# EAGLE design SimplePiddy (EAGLE 6.5.0)
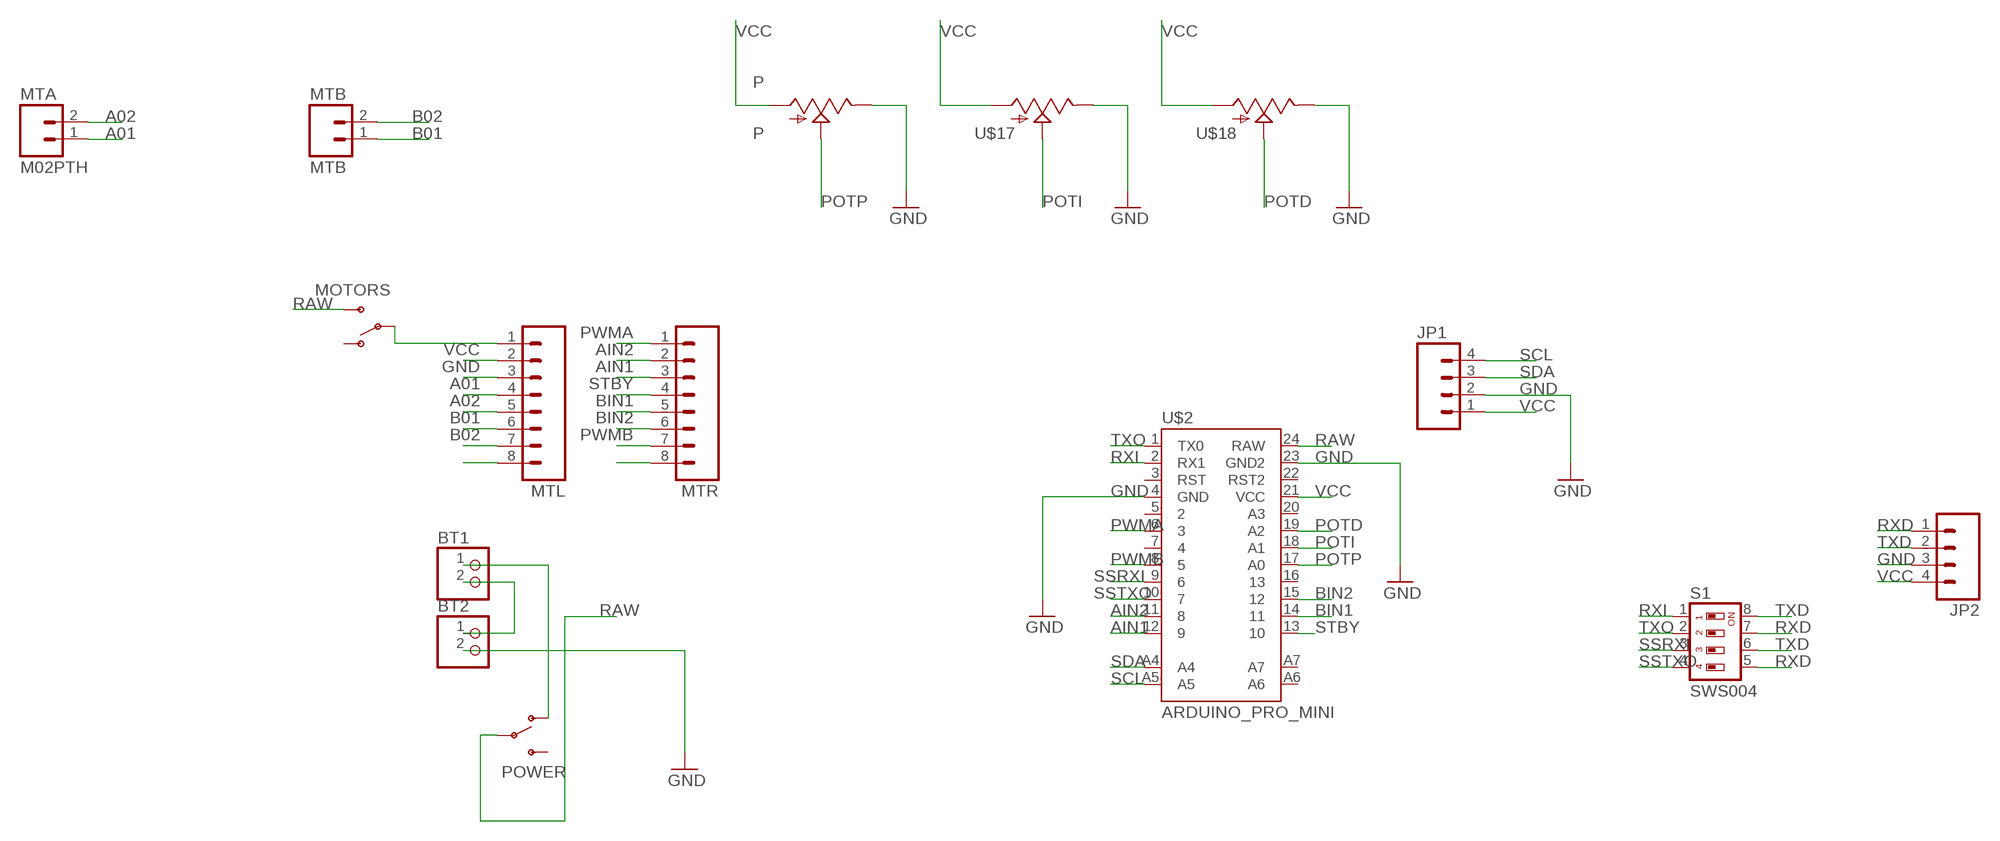
[diagram p0: schematic, sheet 1]

## Parts
BT1  JST_2PIN  [JSTPH2STRAIGHT]
BT2  JST_2PIN  [JSTPH2STRAIGHT]
JP1  M04PTH  [1X04]
JP2  M04PTH  [1X04]
MOTORS  SWITCH-SPDTPTH  [SWITCH-SPDT]
MTA  M02PTH  [1X02]
MTB  MTB  M02PTH  [1X02]
MTL  M08LONGPADS  [1X08_LONGPADS]
MTR  M08LONGPADS  [1X08_LONGPADS]
P  P  POT  [ALPS_POT]
POWER  SWITCH-SPDTPTH  [SWITCH-SPDT]
S1  SWS004  [SMS-004]
U$2  ARDUINO_PRO_MINI  [ARDUINO_PRO_MINI]
U$17  POT  [ALPS_POT]
U$18  POT  [ALPS_POT]

## Nets
A01: MTA.1 MTL.4
A02: MTA.2 MTL.5
AIN1: MTR.3 U$2.12
AIN2: MTR.2 U$2.11
B01: MTB.1 MTL.6
B02: MTB.2 MTL.7
BIN1: MTR.5 U$2.14
BIN2: MTR.6 U$2.15
GND [vcc]: BT2.2 JP1.2 JP2.3 MTL.3 MTL.8 MTR.8 P.P$1(E) U$2.4(GND) U$2.23(GND2) U$17.P$1(E) U$18.P$1(E)
N$1: MOTORS.2(P) MTL.1
N$17: BT1.2 BT2.1
N$18: BT1.1 POWER.1(O)
POTD: U$2.19(A2) U$18.P$2(S)
POTI: U$2.18(A1) U$17.P$2(S)
POTP: P.P$2(S) U$2.17(A0)
PWMA: MTR.1 U$2.6
PWMB: MTR.7 U$2.8
RAW: MOTORS.3(S) POWER.2(P) U$2.24(RAW)
RXD: JP2.1 S1.5 S1.7
RXI: S1.1 U$2.2(RX1)
SCL: JP1.4 U$2.A5
SDA: JP1.3 U$2.A4
SSRXI: S1.3 U$2.9
SSTXO: S1.4 U$2.10
STBY: MTR.4 U$2.13
TXD: JP2.2 S1.6 S1.8
TXO: S1.2 U$2.1(TX0)
VCC: JP1.1 JP2.4 MTL.2 P.P$3(A) U$2.21(VCC) U$17.P$3(A) U$18.P$3(A)
Unconnected: MOTORS.1(O) POWER.3(S) U$2.3(RST) U$2.5 U$2.7 U$2.16 U$2.20(A3) U$2.22(RST2) U$2.A6 U$2.A7

## Library data of the parts
BT1 BT2 = microbuilder:JST_2PIN: JST 2-Pin Right-Angle Connector PH-Series - 4UConnector: 17311 SH-Series - 4UConnector: 07278
JP1 JP2 = SparkFun-Connectors:M04: Header 4 Standard 4-pin 0.1" header. Use with straight break away headers (SKU : PRT-00116), right angle break away headers (PRT-00553), swiss pins (PRT-00743), machine pins (PRT-00117), and female headers (PRT-00115). Molex polarized connector foot print use with SKU : PRT-08231 with associated crimp pins and housings. 1MM SMD Version SKU: PRT-10208
MOTORS POWER = SparkFun-Electromechanical:SWITCH-SPDT: SPDT Switch Simple slide switch, Spark Fun Electronics SKU : COM-00102 DPDT SMT slide switch, AYZ0202, SWCH-08179
MTA MTB = SparkFun-Connectors:M02: Standard 2-pin 0.1" header. Use with - straight break away headers ( PRT-00116) - right angle break away headers (PRT-00553) - swiss pins (PRT-00743) - machine pins (PRT-00117) - female headers (PRT-00115) Molex polarized connector foot print use with: PRT-08233 with associated crimp pins and housings. 2.54_SCREWTERM for use with PRT-10571. 3.5mm Screw Terminal footprints for PRT-08084 5mm Screw Terminal footprints for use with PRT-08433
MTL MTR = SparkFun-Connectors:M08: Header 8 Standard 8-pin 0.1" header. Use with straight break away headers (SKU : PRT-00116), right angle break away headers (PRT-00553), swiss pins (PRT-00743), machine pins (PRT-00117), and female headers (PRT-00115).
P U$17 U$18 = SparkFun-Electromechanical:POT
S1 = smd-special:SWS004: SMD Dip Switch 4 pol.
U$2 = SparkFun-Boards_NoConnector:ARDUINO_PRO_MINI

## Net classes
1 vcc: width 0.254 mm

## Board
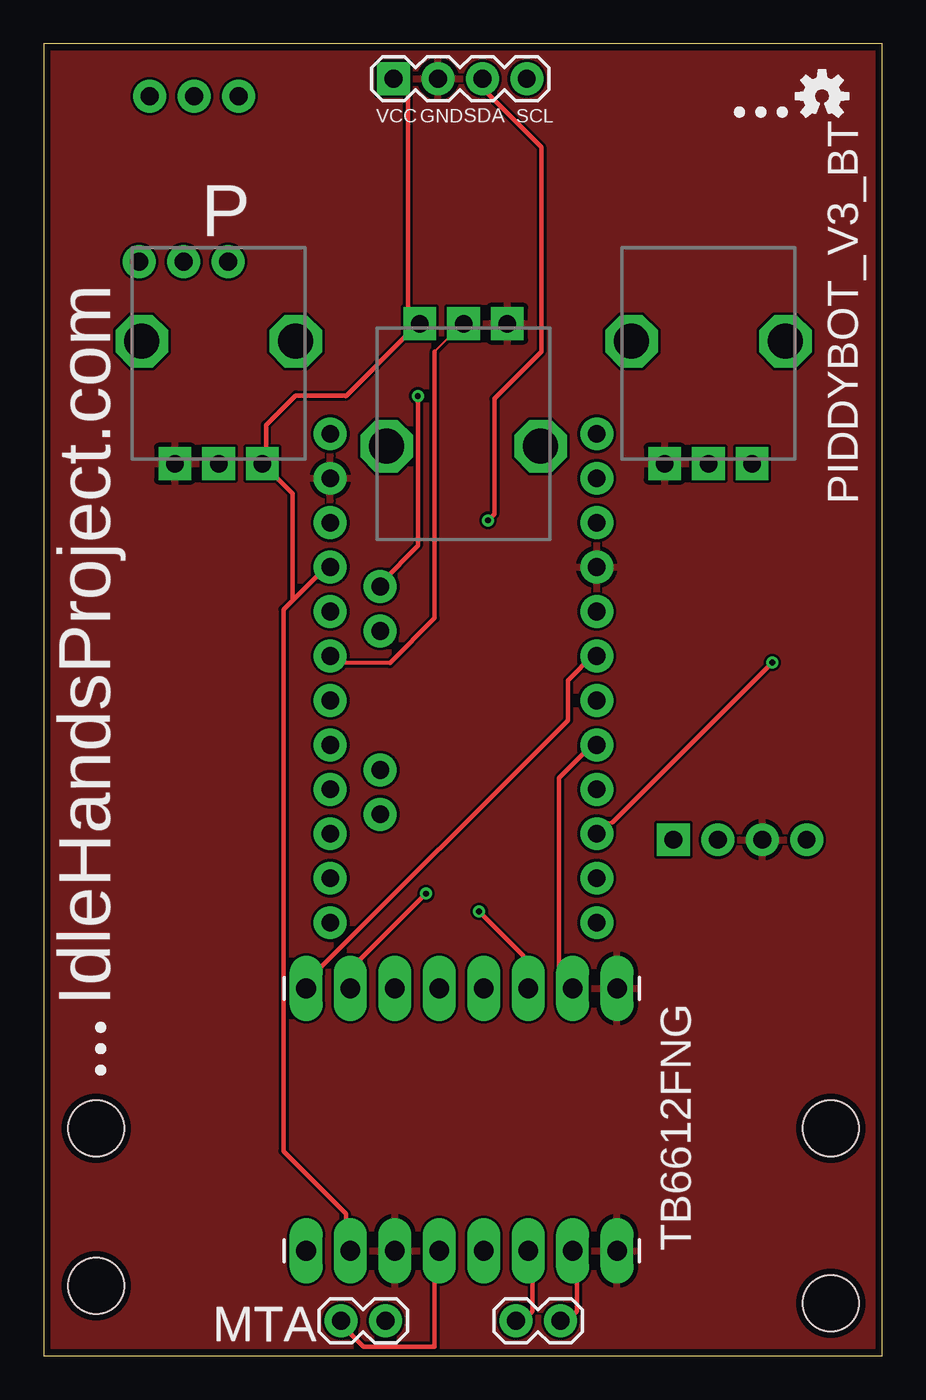
[diagram p1: board, top side]
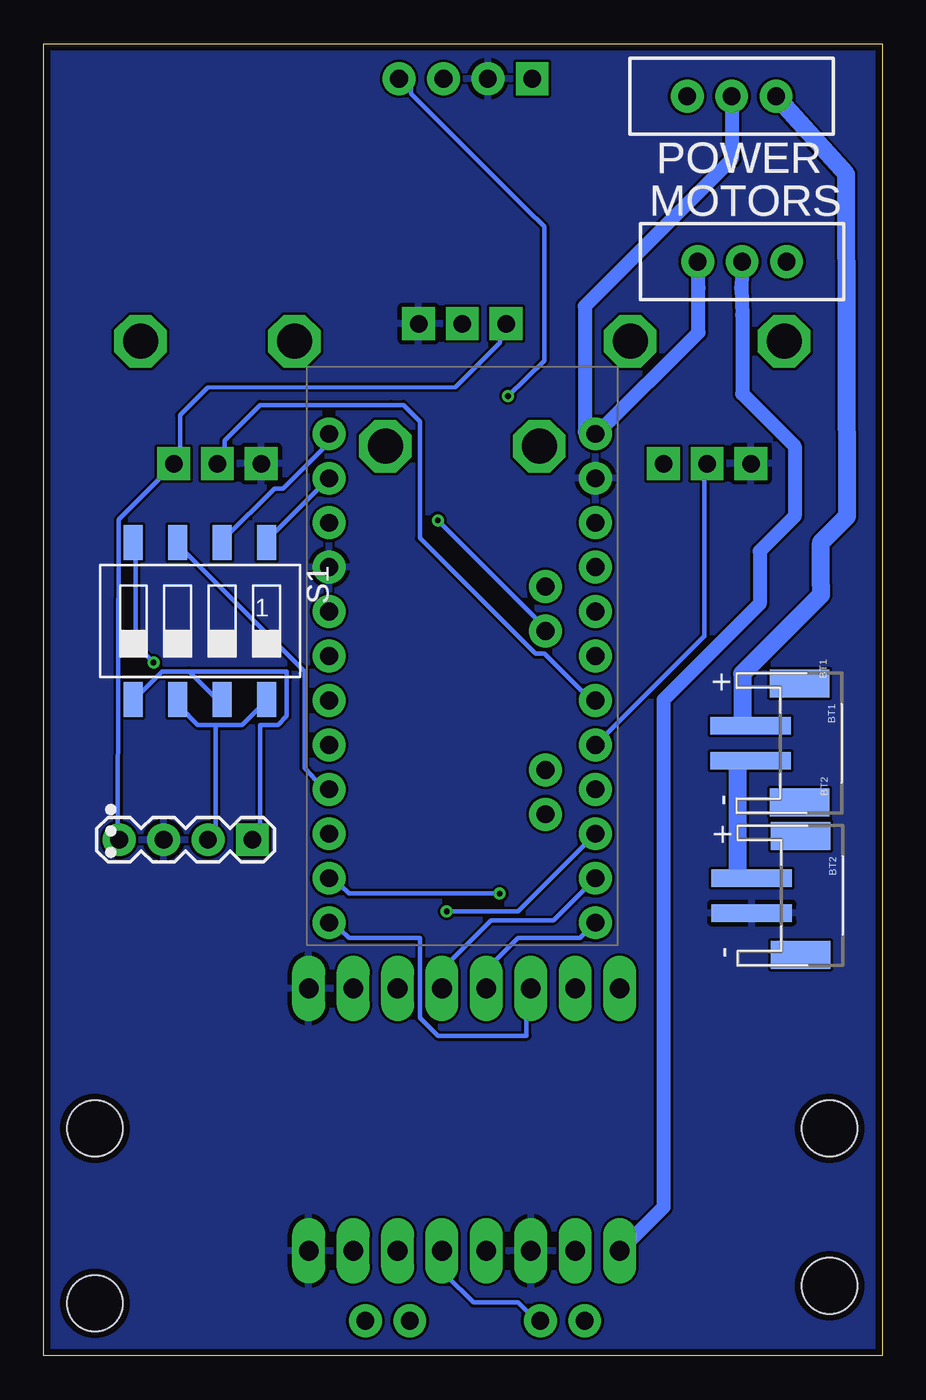
[diagram p2: board, bottom side, seen from below]

Size 47.93 x 75 mm. Coordinates in mm from the lower left corner, seen from the top.
Outline: 0,0 47.93,0 47.93,75 0,75 0,0
Copper layers (1*16): Top 0.0356mm / dielectric 1.5011mm / Bottom 0.0356mm
Design rules "LaenPCBOrder": minimum track width 6mil, minimum drill 13mil, track to track 6mil, track to pad 6mil, pad to pad 6mil, via to via 6mil, smd to smd 6mil, copper to edge 15mil, drill to drill 6mil, minimum pad ring 7mil, minimum via ring 7mil, stop-mask expansion 3mil, vias tented up to drill 0mil, thermal gap 10mil
Holes 3.2 mm at 3,13 3,4 45,3 45,13

### Footprints (pad centres in the part's own frame; a part is rotated, then mirrored left to right if it is on the bottom)
JSTPH2STRAIGHT = smd 1 x 4.6: 1 -1,-3.7; 2 1,-3.7 | smd 1.6 x 3.4: NC1 -3.4,-0.9; NC2 3.4,-0.9
1X04 = drill 1.016 pad 1.88 square: 1 0,0 | drill 1.016 pad 1.88: 2 2.54,0; 3 5.08,0; 4 7.62,0
SWITCH-SPDT = drill 1.016 pad 1.88: 1 0,2.54; 2 0,0; 3 0,-2.54
1X02 = drill 1.016 pad 1.88: 1 0,0; 2 2.54,0
1X08_LONGPADS = drill 1.118 pad 1.88 long: 1 0,0; 2 2.54,0; 3 5.08,0; 4 7.62,0; 5 10.16,0; 6 12.7,0; 7 15.24,0; 8 17.78,0
ALPS_POT = drill 1 pad 1.88 square: P$1 7,-2.5; P$2 7,0; P$3 7,2.5 | drill 2 octagon: P$4 0,-4.4; P$5 0,4.4
SMS-004 = smd 1.092 x 2.007: 1 -3.81,-4.496; 2 -1.27,-4.496; 3 1.27,-4.496; 4 3.81,-4.496; 5 3.81,4.496; 6 1.27,4.496; 7 -1.27,4.496; 8 -3.81,4.496
ARDUINO_PRO_MINI = drill 1.016 pad 1.88: 1 -7.62,12.7; 2 -7.62,10.16; 3 -7.62,7.62; 4 -7.62,5.08; 5 -7.62,2.54; 6 -7.62,0; 7 -7.62,-2.54; 8 -7.62,-5.08; 9 -7.62,-7.62; 10 -7.62,-10.16; 11 -7.62,-12.7; 12 -7.62,-15.24; 13 7.62,-15.24; 14 7.62,-12.7; 15 7.62,-10.16; 16 7.62,-7.62; 17 7.62,-5.08; 18 7.62,-2.54; 19 7.62,0; 20 7.62,2.54; 21 7.62,5.08; 22 7.62,7.62; 23 7.62,10.16; 24 7.62,12.7; A4 4.763,1.429; A5 4.763,3.969; A6 4.763,-9.049; A7 4.763,-6.509

### Placement (x,y rotation side)
BT1  3.81,35.02 270 bottom
BT2  3.75,26.31 270 bottom
JP1  20,73 0 top
JP2  36,29.5 180 bottom
MOTORS  8,62.55 270 bottom
MTA  17,2 0 top
MTB  27,2 0 top
MTL  15,6 0 top
MTR  15,21 0 top
P  10,58 270 top
POWER  8.6,72 270 bottom
S1  39,42 180 bottom
U$1  [OSHW-LOGO-S]  44.5,72 0 top
U$2  24,40 0 bottom
U$3  [ELIPSISLOGO-3MM]  41.5,27.5 90 bottom
U$4  [ELIPSISLOGO-3MM]  38.5,68.5 0 top
U$5  [ELIPSISLOGO-3MM]  5.85,15.05 90 top
U$17  38,58 270 top
U$18  24,52 90 top

### Tracks (layer width: path | path; a pad name or v marks a point on that pad's centre or on a via)
A01
  Top 0.152: 17.27,1.52 MTA.1 | 22.35,5.59 MTL.4
  Top 0.254: 17.27,1.52 18.29,0.51 22.35,0.51 22.35,5.59
A02
  Bottom 0.152: 24.89,4.57 24.89,5.59 MTL.5 | 19.81,2.03 MTA.2
  Bottom 0.254: 19.81,2.03 20.83,3.05 23.37,3.05 24.89,4.57
AIN1
  Bottom 0.152: 30.99,24.38 31.5,24.38 U$2.12 | 20.32,20.83 MTR.3
  Bottom 0.254: 20.32,20.83 20.32,18.29 25.4,18.29 26.42,19.3 26.42,23.88 30.48,23.88 30.99,24.38
AIN2  (via drill 0.33)
  Top 0.152: 16.78,21.34 MTR.2
  Top 0.254: v21.86,26.42 16.78,21.34
  Bottom 0.152: 30.99,26.92 31.5,26.92 U$2.11
  Bottom 0.254: v21.86,26.42 30.48,26.42 30.99,26.92
B01
  Top 0.152: 27.43,2.03 MTB.1 | 27.94,5.59 MTL.6
  Top 0.254: 27.43,2.03 27.94,2.54 27.94,5.59
B02
  Top 0.152: 29.97,2.03 MTB.2 | 30.48,5.59 MTL.7
  Top 0.254: 29.97,2.03 30.48,2.54 30.48,5.59
BIN1
  Bottom 0.152: 24.89,22.35 24.89,21.34 MTR.5 | 16.76,26.92 U$2.14
  Bottom 0.254: 16.76,26.92 18.8,24.89 22.35,24.89 24.89,22.35
BIN2  (via drill 0.33)
  Top 0.152: 27.43,22.86 27.43,21.34 MTR.6
  Top 0.254: 27.43,22.86 v24.89,25.4
  Bottom 0.152: 16.76,29.46 U$2.15
  Bottom 0.254: 16.76,29.46 20.83,25.4 v24.89,25.4
GND
  pour Bottom: 0,75 48,75 48,0 0,0
  pour Top: 0,75 48,75 48,0 0,0
N$1
  Bottom 0.813: MOTORS.2 8.05,61.05 8,59.5 8,55 5,52 5,48 7,46 7,43 12.5,37.5 12.5,8.5 MTL.1
N$17
  Bottom 0.406: BT2.1 8.25,27.42 | 8.25,34.02 BT1.2
  Bottom 1.016: 8.25,27.42 8.25,34.02
N$18
  Bottom 1.016: POWER.1 2.05,67.54 2,48 3.5,46.5 3.5,44 3.5,43.5 8,39 8,36.03 BT1.1
POTD
  Top 0.152: 16.76,39.62 U$2.19 | 22.35,57.4 23.88,58.93 U$18.P$2
  Top 0.254: 16.76,39.62 19.79,39.6 22.35,42.16 22.35,57.4
POTI
  Bottom 0.152: 16.76,37.59 U$2.18 | 37.59,51.31 U$17.P$2
  Bottom 0.254: 16.76,37.59 19.3,40.13 19.81,40.13 26.42,46.74 26.42,53.41 27.36,54.35 28.1,54.35 35.56,54.36 37.59,52.32 37.59,51.31
POTP
  Bottom 0.152: 16.26,35.05 U$2.17 | 10.16,50.8 P.P$2
  Bottom 0.254: 16.26,35.05 10.16,41.15 10.16,50.8
PWMA
  Top 0.152: 15.24,21.59 MTR.1 | 31.5,40.13 U$2.6
  Top 0.254: 15.24,21.59 29.97,36.32 29.97,38.61 31.5,40.13
PWMB
  Top 0.152: 29.46,21.84 29.97,21.34 MTR.7 | 31.5,35.05 U$2.8
  Top 0.254: 29.46,21.84 29.46,33.02 31.5,35.05
RAW
  Bottom 0.813: POWER.2 8.6,68.4 17,60 17,52.82 U$2.24 16.3,52.7 10.5,58.5 10.5,61.04 MOTORS.3
RXD
  Bottom 0.152: 38.1,37.59 S1.7 | 42.67,37.59 S1.5 | 35.56,29.42 JP2.1
  Bottom 0.254: 39.62,39.12 38.1,37.59 | 39.62,39.12 41.15,39.12 42.67,37.59 | 35.56,29.42 35.56,36.07 34.54,36.07 34.04,36.58 34.04,39.12 39.62,39.12
RXI
  Bottom 0.152: 35.05,46.74 S1.1 | 32,49.78 U$2.2
  Bottom 0.254: 32,49.78 35.05,46.74
SCL  (via drill 0.33)
  Top 0.152: 19.3,44.2 U$2.A5
  Top 0.254: 19.3,44.2 21.39,46.33 v21.39,54.86
  Bottom 0.152: 26.92,72.64 27.43,72.64 JP1.4
  Bottom 0.254: v21.39,54.86 19.3,56.9 19.3,64.53 20.32,65.53 26.92,72.14 26.92,72.64
SDA  (via drill 0.33)
  Top 0.152: 25.4,72.14 25.4,72.64 JP1.3
  Top 0.254: v25.4,47.75 25.76,48.11 25.76,54.71 28.45,57.4 28.45,69.09 25.4,72.14
  Bottom 0.152: 19.3,41.66 U$2.A4
  Bottom 0.254: v25.4,47.75 19.3,41.66
SSRXI
  Bottom 0.152: 40.13,46.23 S1.3 | 32,32.51 U$2.9
  Bottom 0.254: 40.13,46.23 33.02,39.12 33.02,33.61 32,32.51
SSTXO  (via drill 0.33)
  Top 0.152: 32.51,30.48 32,30.48 32,29.97 U$2.10
  Top 0.254: 32.51,30.48 v41.66,39.62
  Bottom 0.152: 42.67,46.23 S1.4
  Bottom 0.254: 42.67,46.23 42.67,40.62 v41.66,39.62
STBY
  Bottom 0.152: 22.35,22.35 22.35,21.34 MTR.4 | 16.76,24.38 U$2.13
  Bottom 0.254: 16.76,24.38 17.27,23.88 20.83,23.88 22.35,22.35
TXD
  Bottom 0.152: 35.56,37.08 S1.8 | 40.13,37.08 S1.6 | 38.1,29.42 JP2.2
  Bottom 0.254: 35.56,37.08 36.58,36.07 38.1,36.07 | 38.1,36.07 39.12,36.07 40.13,37.08 | 38.1,29.42 38.1,36.07
TXO
  Bottom 0.152: 37.59,46.74 S1.2 | 31.5,52.32 U$2.1
  Bottom 0.254: 37.59,46.74 34.74,49.58 34.24,49.58 31.5,52.32
VCC
  Top 0.152: 17.27,6.1 MTL.2 | 16.26,45.21 U$2.21 | 12.7,51.31 P.P$3 | 20.83,72.14 20.32,72.64 JP1.1 | 20.83,58.42 21.34,58.93 U$18.P$3 20.83,58.42
  Top 0.254: 17.27,6.1 17.27,8.13 13.71,11.69 13.71,42.66 14.22,43.18 | 16.26,45.21 14.22,43.18 | P.P$3 14.22,49.28 14.22,43.18 | 20.83,72.14 20.83,58.42 17.27,54.86 17.24,54.9 14.4,54.9 12.7,53.2 12.7,51.31
  Bottom 0.152: 40.13,51.31 U$17.P$3 40.64,50.8 | 21.84,58.93 U$18.P$3 | 43.69,29.92 JP2.4
  Bottom 0.254: 40.13,51.31 40.13,53.77 38.55,55.35 24.38,55.37 21.84,57.91 21.84,58.93 | 43.69,29.92 43.64,47.8 40.64,50.8

### Text on the board
tPlace: IdleHandsProject.com
tNames: PIDDYBOT_V3_BT | TB6612FNG
_tNames: MTA
_bNames: POWER | MOTORS | S1 | BT1 | BT2
_tValues: P | MTB